# EAGLE design SDDD-PulseBoard-1.0 (EAGLE 7.6.0)

## Sheet 1 of 2
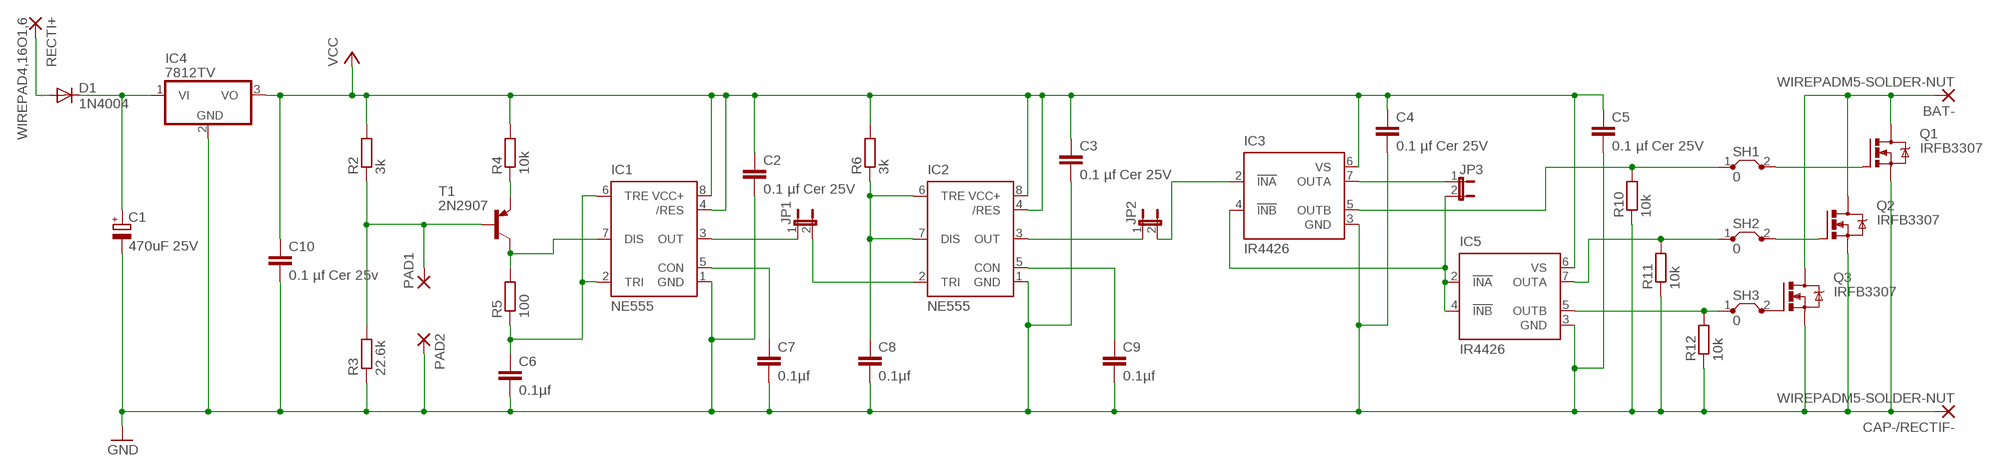
[diagram p0: schematic, sheet 1]

### Parts
BAT-  WIREPADM5-SOLDER-NUT  [M5-SOLDER-NUT]
C1  470uF 25V  CPOL-EUE5-8.5  [E5-8,5]
C2  0.1 µf Cer 25V  C-EU050-025X075  [C050-025X075]
C3  0.1 µf Cer 25V  C-EU050-025X075  [C050-025X075]
C4  0.1 µf Cer 25V  C-EU050-025X075  [C050-025X075]
C5  0.1 µf Cer 25V  C-EU050-025X075  [C050-025X075]
C6  0.1µf  C-EU050-025X075  [C050-025X075]
C7  0.1µf  C-EU050-025X075  [C050-025X075]
C8  0.1µf  C-EU050-025X075  [C050-025X075]
C9  0.1µf  C-EU050-025X075  [C050-025X075]
C10  0.1 µf Cer 25v  C-EU050-025X075  [C050-025X075]
CAP-/RECTIF-  WIREPADM5-SOLDER-NUT  [M5-SOLDER-NUT]
D1  1N4004  [DO41-10]
IC1  NE555  [DIL-08]
IC2  NE555  [DIL-08]
IC3  IR4426  [DIL08]
IC4  7812TV  [TO220V]
IC5  IR4426  [DIL08]
JP1  JP1E  [JP1]
JP2  JP1E  [JP1]
JP3  JP1E  [JP1]
PAD1  2,15/1,0  [2,15/1,0]
PAD2  2,15/1,0  [2,15/1,0]
Q1  IRFB3307  IRF540  [TO220BV]
Q2  IRFB3307  IRF540  [TO220BV]
Q3  IRFB3307  IRF540  [TO220BV]
R2  3k  R-EU_0207/10  [0207/10]
R3  22.6k  R-EU_0207/10  [0207/10]
R4  10k  R-EU_0207/10  [0207/10]
R5  100  R-EU_0207/10  [0207/10]
R6  3k  R-EU_0207/10  [0207/10]
R10  10k  R-EU_0207/10  [0207/10]
R11  10k  R-EU_0207/10  [0207/10]
R12  10k  R-EU_0207/10  [0207/10]
RECTI+  WIREPAD4,16O1,6  [4,16O1,6]
SH1  0  J30MM  [30]
SH2  0  J30MM  [30]
SH3  0  J30MM  [30]
T1  2N2907  MPS2907A-PNP-TO92-CBE  [TO92-CBE]

### Nets
GND: C1.- C2.2 C3.2 C4.2 C5.2 C6.2 C7.2 C8.2 C9.2 C10.2 CAP-/RECTIF-.1(P) CAP-/RECTIF-.P$1(P) CAP-/RECTIF-.P$2(P) CAP-/RECTIF-.P$3(P) CAP-/RECTIF-.P$4(P) CAP-/RECTIF-.P$5(P) CAP-/RECTIF-.P$6(P) CAP-/RECTIF-.P$7(P) CAP-/RECTIF-.P$8(P) CAP-/RECTIF-.P$9(P) CAP-/RECTIF-.P$10(P) CAP-/RECTIF-.P$11(P) CAP-/RECTIF-.P$12(P) CAP-/RECTIF-.P$13(P) CAP-/RECTIF-.P$14(P) CAP-/RECTIF-.P$15(P) CAP-/RECTIF-.P$16(P) CAP-/RECTIF-.P$17(P) CAP-/RECTIF-.P$18(P) CAP-/RECTIF-.P$19(P) CAP-/RECTIF-.P$20(P) CAP-/RECTIF-.P$21(P) CAP-/RECTIF-.P$22(P) CAP-/RECTIF-.P$23(P) CAP-/RECTIF-.P$24(P) CAP-/RECTIF-.P$25(P) CAP-/RECTIF-.P$26(P) CAP-/RECTIF-.P$27(P) CAP-/RECTIF-.P$28(P) CAP-/RECTIF-.P$29(P) CAP-/RECTIF-.P$30(P) CAP-/RECTIF-.P$31(P) CAP-/RECTIF-.P$32(P) CAP-/RECTIF-.P$33(P) CAP-/RECTIF-.P$34(P) CAP-/RECTIF-.P$35(P) CAP-/RECTIF-.P$36(P) CAP-/RECTIF-.P$37(P) CAP-/RECTIF-.P$38(P) CAP-/RECTIF-.P$39(P) CAP-/RECTIF-.P$40(P) CAP-/RECTIF-.P$41(P) CAP-/RECTIF-.P$42(P) CAP-/RECTIF-.P$43(P) CAP-/RECTIF-.P$44(P) CAP-/RECTIF-.P$45(P) CAP-/RECTIF-.P$46(P) CAP-/RECTIF-.P$47(P) CAP-/RECTIF-.P$48(P) CAP-/RECTIF-.P$49(P) CAP-/RECTIF-.P$50(P) CAP-/RECTIF-.P$51(P) CAP-/RECTIF-.P$52(P) CAP-/RECTIF-.P$53(P) CAP-/RECTIF-.P$54(P) CAP-/RECTIF-.P$55(P) CAP-/RECTIF-.P$56(P) CAP-/RECTIF-.P$57(P) CAP-/RECTIF-.P$58(P) CAP-/RECTIF-.P$59(P) CAP-/RECTIF-.P$60(P) CAP-/RECTIF-.P$61(P) CAP-/RECTIF-.P$62(P) CAP-/RECTIF-.P$63(P) CAP-/RECTIF-.P$64(P) CAP-/RECTIF-.P$65(P) CAP-/RECTIF-.P$66(P) CAP-/RECTIF-.P$67(P) CAP-/RECTIF-.P$68(P) CAP-/RECTIF-.P$69(P) CAP-/RECTIF-.P$70(P) CAP-/RECTIF-.P$71(P) CAP-/RECTIF-.P$72(P) CAP-/RECTIF-.P$73(P) CAP-/RECTIF-.P$74(P) CAP-/RECTIF-.P$75(P) CAP-/RECTIF-.P$76(P) CAP-/RECTIF-.P$77(P) CAP-/RECTIF-.P$78(P) CAP-/RECTIF-.P$79(P) CAP-/RECTIF-.P$80(P) IC1.1(GND) IC2.1(GND) IC3.3(GND) IC4.2(GND) IC5.3(GND) PAD2.1(P) Q1.S Q2.S Q3.S R3.1 R10.1 R11.1 R12.1
N$1: IC3.5(OUTB) R10.2 SH1.1
N$2: PAD1.1(P) R2.1 R3.2 T1.B
N$3: C6.1 IC1.2(TRI) IC1.6(TRE) R5.1
N$4: Q1.G SH1.2
N$5: BAT-.1(P) BAT-.P$1(P) BAT-.P$2(P) BAT-.P$3(P) BAT-.P$4(P) BAT-.P$5(P) BAT-.P$6(P) BAT-.P$7(P) BAT-.P$8(P) BAT-.P$9(P) BAT-.P$10(P) BAT-.P$11(P) BAT-.P$12(P) BAT-.P$13(P) BAT-.P$14(P) BAT-.P$15(P) BAT-.P$16(P) BAT-.P$17(P) BAT-.P$18(P) BAT-.P$19(P) BAT-.P$20(P) BAT-.P$21(P) BAT-.P$22(P) BAT-.P$23(P) BAT-.P$24(P) BAT-.P$25(P) BAT-.P$26(P) BAT-.P$27(P) BAT-.P$28(P) BAT-.P$29(P) BAT-.P$30(P) BAT-.P$31(P) BAT-.P$32(P) BAT-.P$33(P) BAT-.P$34(P) BAT-.P$35(P) BAT-.P$36(P) BAT-.P$37(P) BAT-.P$38(P) BAT-.P$39(P) BAT-.P$40(P) BAT-.P$41(P) BAT-.P$42(P) BAT-.P$43(P) BAT-.P$44(P) BAT-.P$45(P) BAT-.P$46(P) BAT-.P$47(P) BAT-.P$48(P) BAT-.P$49(P) BAT-.P$50(P) BAT-.P$51(P) BAT-.P$52(P) BAT-.P$53(P) BAT-.P$54(P) BAT-.P$55(P) BAT-.P$56(P) BAT-.P$57(P) BAT-.P$58(P) BAT-.P$59(P) BAT-.P$60(P) BAT-.P$61(P) BAT-.P$62(P) BAT-.P$63(P) BAT-.P$64(P) BAT-.P$65(P) BAT-.P$66(P) BAT-.P$67(P) BAT-.P$68(P) BAT-.P$69(P) BAT-.P$70(P) BAT-.P$71(P) BAT-.P$72(P) BAT-.P$73(P) BAT-.P$74(P) BAT-.P$75(P) BAT-.P$76(P) BAT-.P$77(P) BAT-.P$78(P) BAT-.P$79(P) BAT-.P$80(P) Q1.D Q2.D Q3.D
N$6: IC5.7(OUTA) R11.2 SH2.1
N$7: Q2.G SH2.2
N$8: IC5.5(OUTB) R12.2 SH3.1
N$9: R4.1 T1.E
N$10: IC1.7(DIS) R5.2 T1.C
N$11: Q3.G SH3.2
N$12: C7.1 IC1.5(CON)
N$13: C8.1 IC2.6(TRE) IC2.7(DIS) R6.1
N$14: IC1.3(OUT) JP1.1
N$15: IC2.2(TRI) JP1.2
N$16: IC2.3(OUT) JP2.1
N$17: IC3.2(!INA) JP2.2
N$18: IC3.7(OUTA) JP3.1
N$19: IC3.4(!INB) IC5.2(!INA) IC5.4(!INB) JP3.2
N$20: C1.+ D1.C IC4.1(VI)
N$21: C9.1 IC2.5(CON)
N$22: D1.A RECTI+.1(P)
VCC: C2.1 C3.1 C4.1 C5.1 C10.1 IC1.4(/RES) IC1.8(VCC+) IC2.4(/RES) IC2.8(VCC+) IC3.6(VS) IC4.3(VO) IC5.6(VS) R2.2 R4.2 R6.2

## Sheet 2 of 2

## Library data of the parts
BAT- CAP-/RECTIF- = wirepad-SDDD:WIREPAD: Wire PAD connect wire on PCB
C1 = rcl:CPOL-EU: POLARIZED CAPACITOR, European symbol
C2-C10 = rcl:C-EU: CAPACITOR, European symbol
D1 = diode:1N4004: DIODE general purpose rectifier, 1 A
IC1 IC2 = st-microelectronics:NE555: General purpose bipolar Timer; MF: Arrow Electronics; MPN: NE555N; OC_FARNELL: 1467742; OC_NEWARK: 89K1486
IC3 IC5 = ir:IR4426: DUAL LOW SIDE DRIVER Source: ID4426.pdf; MF: INTERNATIONAL RECTIFIER(IR); MPN: IR4426PBF; OC_FARNELL: 1023265; OC_NEWARK: 19K8460
IC4 = linear:78*: Positive VOLTAGE REGULATOR Source: http://cache.national.com/ds/LM/LM78L05.pdf http://www.fairchildsemi.com/ds/LM/LM7805.pdf
JP1-JP3 = jumper:JP1E: JUMPER
PAD1 PAD2 = wirepad:2,15/1,0: THROUGH-HOLE PAD
Q1-Q3 = transistor-power:IRF540: HEXFET Power MOSFET
R2-R6 R10-R12 = resistor:R-EU_: RESISTOR, European symbol
RECTI+ = wirepad:WIREPAD: Wire PAD connect wire on PCB
SH1-SH3 = jumper:J: Bridge
T1 = transistor:*-PNP-: PNP Transistror

## Board
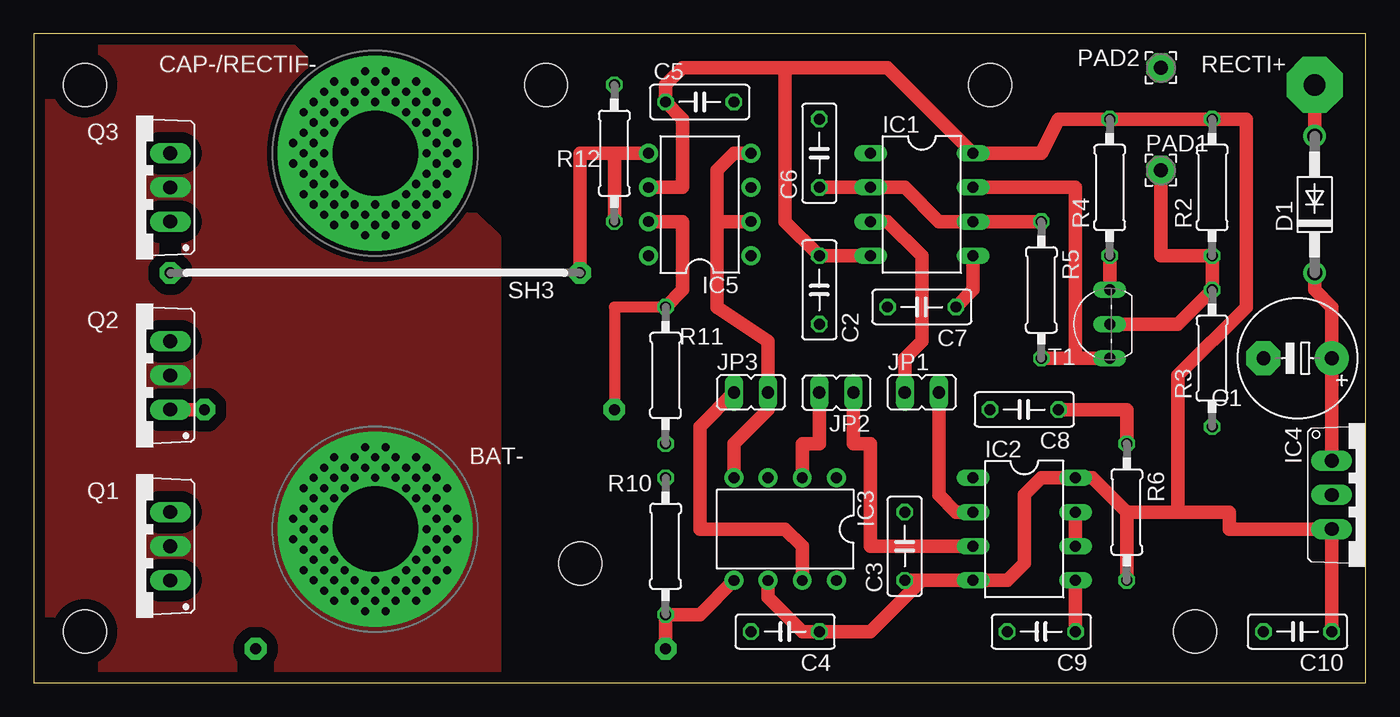
[diagram p1: board, top side]
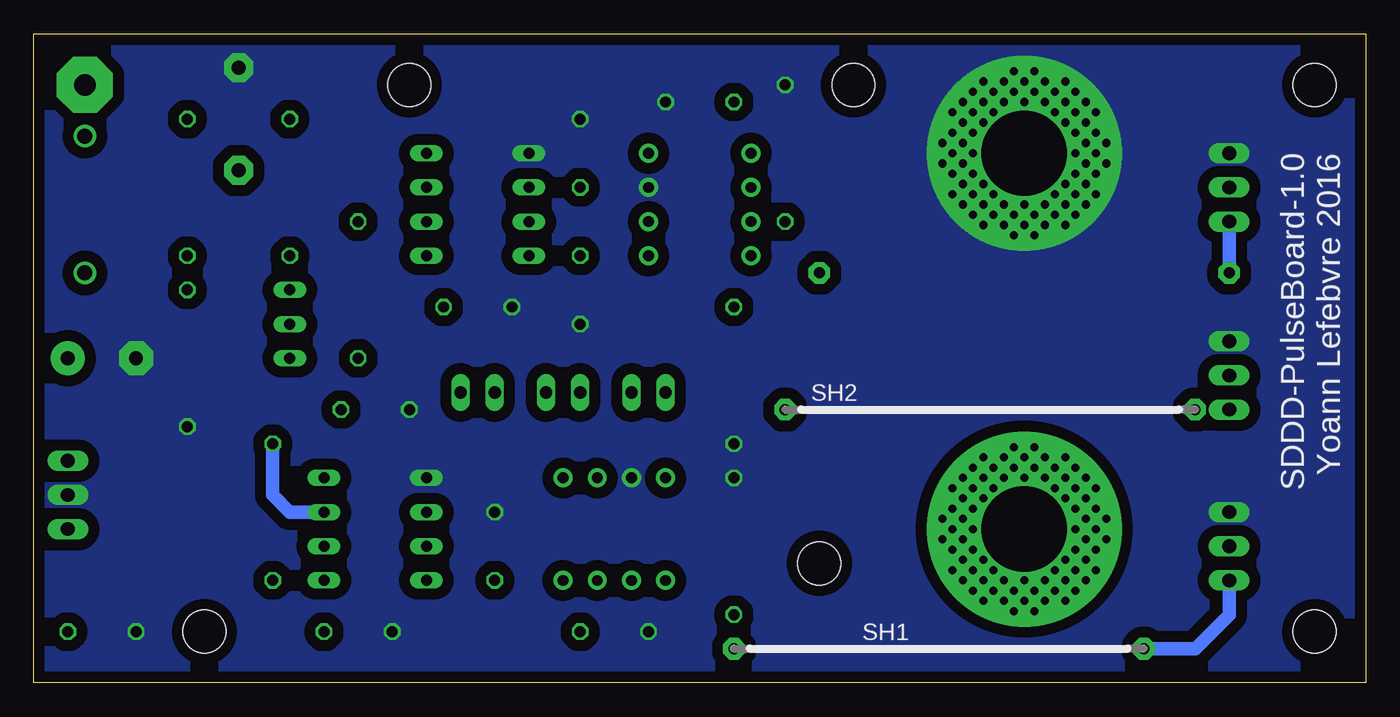
[diagram p2: board, bottom side, seen from below]

Size 99.06 x 48.26 mm. Coordinates in mm from the lower left corner, seen from the top.
Outline: 0,0 99.06,0 99.06,48.26 0,48.26 0,0
Copper layers (1*16): Top 0.035mm / dielectric 1.6mm / Bottom 0.035mm
Design rules "Elecrow_2-layer_PCB_eagle_rule": minimum track width 6mil, minimum drill 12mil, track to track 6mil, track to pad 6mil, pad to pad 6mil, via to via 8mil, smd to smd 0mil, copper to edge 20mil, drill to drill 10mil, minimum pad ring 6mil, minimum via ring 6mil, stop-mask expansion 0mil, vias tented up to drill 100mil, thermal gap 10mil
Holes 3.2 mm at 71.12,44.45 3.81,44.45 3.81,3.81 86.36,3.81 38.1,44.45 40.64,8.89

### Footprints (pad centres in the part's own frame; a part is rotated, then mirrored left to right if it is on the bottom)
M5-SOLDER-NUT = drill 6.35 pad 14.478: 1 0,0 | drill 0.6 pad 0.61: P$1 0,5.334; P$2 0.762,4.572; P$3 1.524,3.81; P$4 2.286,4.572; P$5 1.524,5.334; P$6 -0.762,4.572; P$7 -1.524,5.334; P$8 -2.286,4.572; P$9 -3.048,3.81; P$10 -3.81,3.048; P$11 -3.81,4.572; P$12 -4.572,3.81; P$13 -4.572,2.286; P$14 -5.334,1.524; P$15 -6.096,0.762; P$16 -5.334,3.048; P$17 -3.048,5.334; P$18 2.286,3.048; P$19 3.048,2.286; P$20 3.81,1.524; P$21 4.572,0.762; P$22 4.572,2.286; P$23 3.81,3.048; P$24 3.048,3.81; P$25 3.81,0; P$26 4.572,-0.762; P$27 5.334,0; P$28 5.334,1.524; P$29 3.81,-1.524; P$30 5.334,-1.524; P$31 4.572,-2.286; P$32 -4.572,0.762; P$33 -5.334,0; P$34 -4.572,-0.762; P$35 -3.81,0; P$36 -3.81,1.524; P$37 -3.048,2.286; P$38 -2.286,3.048; P$39 -1.524,3.81; P$40 0.762,-6.096; P$41 0,3.81; P$42 -5.334,-1.524; P$43 -6.096,-0.762; P$44 -3.81,-1.524; P$45 -4.572,-2.286; P$46 -3.81,-3.048; P$47 -3.048,-2.286; P$48 -2.286,-3.048; P$49 -1.524,-3.81; P$50 -3.048,-3.81; P$51 -3.81,-4.572; P$52 -4.572,-3.81; P$53 -5.334,-3.048; P$54 -3.048,-5.334; P$55 -2.286,-4.572; P$56 -1.524,-5.334; P$57 -0.762,-4.572; P$58 3.81,-3.048; P$59 3.048,-3.81; P$60 2.286,-4.572; P$61 1.524,-5.334; P$62 0,-5.334; P$63 0,-3.81; P$64 1.524,-3.81; P$65 0.762,-4.572; P$66 2.286,-3.048; P$67 3.048,-2.286; P$68 3.048,5.334; P$69 3.81,4.572; P$70 4.572,3.81; P$71 5.334,3.048; P$72 5.334,-3.048; P$73 4.572,-3.81; P$74 3.81,-4.572; P$75 3.048,-5.334; P$76 -0.762,-6.096; P$77 6.096,0.762; P$78 -0.762,6.096; P$79 0.762,6.096; P$80 6.096,-0.762
E5-8,5 = drill 1.016 pad 2.54: + -2.54,0 | drill 1.016 pad 2.54 octagon: - 2.54,0
C050-025X075 = drill 0.813 octagon: 1 -2.54,0; 2 2.54,0
DO41-10 = drill 1.118: A 5.08,0; C -5.08,0
DIL-08 = drill 0.813 long: 1 -3.81,-3.81; 2 -1.27,-3.81; 3 1.27,-3.81; 4 3.81,-3.81; 5 3.81,3.81; 6 1.27,3.81; 7 -1.27,3.81; 8 -3.81,3.81
DIL08 = drill 0.8 pad 1.4: 1 -3.81,-3.81; 2 -1.27,-3.81; 3 1.27,-3.81; 4 3.81,-3.81; 5 3.81,3.81; 6 1.27,3.81; 7 -1.27,3.81; 8 -3.81,3.81
TO220V = drill 1.016 long: 1 -2.54,-2.54; 2 0,-2.54; 3 2.54,-2.54
JP1 = drill 0.914 long: 1 0,-1.27; 2 0,1.27
2,15/1,0 = drill 1.016 pad 2.159 octagon: 1 0,0
TO220BV = drill 1.016 long: D 0,-2.54; G -2.54,-2.54; S 2.54,-2.54
0207/10 = drill 0.813 octagon: 1 -5.08,0; 2 5.08,0
4,16O1,6 = drill 1.6 pad 4.166 octagon: 1 0,0
30 = drill 0.813 pad 1.6 octagon: 1 -15.24,0; 2 15.24,0
TO92-CBE = drill 0.813 long: B 0,0; C -2.54,0; E 2.54,0

### Placement (x,y rotation side)
BAT-  25.4,11.43 0 top
C1  93.98,24.13 180 top
C2  58.42,29.21 270 top
C3  64.77,10.16 90 top
C4  55.88,3.81 180 top
C5  49.53,43.18 0 top
C6  58.42,39.37 90 top
C7  66.04,27.94 180 top
C8  73.66,20.32 180 top
C9  74.93,3.81 180 top
C10  93.98,3.81 180 top
CAP-/RECTIF-  25.4,39.37 0 top
D1  95.25,35.56 90 top
IC1  66.04,35.56 270 top
IC2  73.66,11.43 270 top
IC3  55.88,11.43 180 top
IC4  99.06,13.97 270 top
IC5  49.53,35.56 90 top
JP1  66.04,21.59 270 top
JP2  59.69,21.59 90 top
JP3  53.34,21.59 270 top
PAD1  83.82,38.1 0 top
PAD2  83.82,45.72 0 top
Q1  7.62,10.16 90 top
Q2  7.62,22.86 90 top
Q3  7.62,36.83 90 top
R2  87.63,36.83 90 top
R3  87.63,24.13 90 top
R4  80.01,36.83 90 top
R5  74.93,29.21 270 top
R6  81.28,12.7 270 top
R10  46.99,10.16 270 top
R11  46.99,22.86 90 top
R12  43.18,39.37 270 top
RECTI+  95.25,44.45 0 top
SH1  31.75,2.54 0 bottom
SH2  27.94,20.32 0 bottom
SH3  25.4,30.48 180 top
T1  80.01,26.67 90 top

### Tracks (layer width: path | path; a pad name or v marks a point on that pad's centre or on a via)
GND
  pour Bottom (isolate 0.813, no thermals): 0.51,47.75 98.55,47.75 98.55,0.51 0.51,0.51
N$1
  Top 1.016: IC3.5 49.53,5.08 R10.2 SH1.1
N$2
  Top 1.016: T1.B 85.09,26.67 R3.2 R2.1 83.82,31.75 PAD1.1
N$3
  Top 1.016: R5.1 IC1.6 67.31,34.29 64.77,36.83 IC1.2 C6.1
N$4
  Bottom 1.016: SH1.2 12.7,2.54 10.16,5.08 Q1.G
N$5
  pour Top (isolate 0.813, no thermals): 0,48.26 17.78,48.26 34.29,33.02 34.29,0 0,0
N$6
  Top 0.813: R11.2 43.18,27.94 SH2.1
  Top 1.016: IC5.7 48.26,34.29 48.26,29.21 R11.2
N$7
  Top 1.016: SH2.2 Q2.G
N$8
  Top 1.016: SH3.1 40.64,39.37 43.18,39.37 | 43.18,39.37 IC5.5 | R12.2 43.18,39.37
N$9
  Top 1.016: R4.1 T1.E
N$10
  Top 1.016: T1.C 77.47,24.13 | R5.2 77.47,24.13 | 77.47,24.13 77.47,36.83 IC1.7
N$11
  Bottom 1.016: SH3.2 Q3.G
N$12
  Top 1.016: C7.1 69.85,29.21 IC1.5
N$13
  Top 1.016: IC2.6 IC2.7 | R6.1 81.28,20.32 C8.1
  Bottom 1.016: IC2.7 80.01,12.7 81.28,13.97 R6.1
N$14
  Top 1.016: JP1.1 64.77,24.13 66.04,25.4 66.04,31.75 63.5,34.29 IC1.3
N$15
  Top 1.016: JP1.2 67.31,13.97 68.58,12.7 IC2.2
N$16
  Top 1.016: JP2.1 60.96,17.78 62.23,17.78 62.23,10.16 IC2.3
N$17
  Top 1.016: IC3.2 57.15,17.78 58.42,17.78 JP2.2
N$18
  Top 1.016: JP3.1 49.53,19.05 49.53,11.43 55.88,11.43 57.15,10.16 IC3.7
N$19
  Top 1.016: IC3.4 52.07,17.78 54.61,20.32 JP3.2 54.61,25.4 50.8,27.94 50.8,34.29 | 50.8,34.29 IC5.2 | IC5.4 52.07,39.37 50.8,38.1 50.8,34.29
N$20
  Top 1.016: IC4.1 C1.+ 96.52,27.94 95.25,29.21 D1.C
N$21
  Top 1.016: C9.1 IC2.5
N$22
  Top 1.016: RECTI+.1 D1.A
VCC
  Top 1.016: 81.28,12.7 78.74,15.24 IC2.8 74.93,15.24 73.66,13.97 73.66,8.89 72.39,7.62 IC2.4 C3.1 66.04,7.62 62.23,3.81 C4.1 57.15,3.81 54.61,6.35 IC3.6 | 81.28,12.7 R6.2 | R2.2 R4.2 | IC1.4 C2.1 55.88,34.29 55.88,45.72 | R4.2 90.17,41.91 90.17,27.94 85.09,22.86 85.09,12.7 | R4.2 76.2,41.91 74.93,39.37 IC1.8 63.5,45.72 55.88,45.72 | 55.88,45.72 48.26,45.72 46.99,44.45 C5.1 48.26,41.91 48.26,36.83 IC5.6 | 81.28,12.7 85.09,12.7 | 85.09,12.7 88.9,12.7 88.9,11.43 IC4.3 C10.1

### Text on the board
bNames: SDDD-PulseBoard-1.0 / Yoann Lefebvre 2016